# Altium schematic sheet Operational_amplifier.SchDoc: Наименование
size 209 x 297 mm; ApprovedBy: Утвердил; CheckedBy: Проверил; Author: Разработал; CompanyName: Организация; DrawnBy: Н.Контр; Engineer: Т.Контр; SheetNumber: 5; SheetTotal: 6; PageSetup: Record=PageOptions|CenterHorizontal=True|CenterVertical=True|PrintScale=0.94|XCorrection=1.00|YCorrection=1.00|PrintKind=1|BorderSize=5000000|LeftOffset=0|BottomOffset=0|Orientation=1|PaperLength=1000|PaperWidth=1000|Scale=100|PaperSource=7|PrintQuality=-4|MediaType=1|DitherType=10|PaperKind=A4|PrintScaleMode=1; DecimalNumber: Децимальный номер; HeadOfSector: Нач. сектора; MainDevice: Перв.примен.; Name: Наименование; DocumentName: Sheet1.SCHDOC
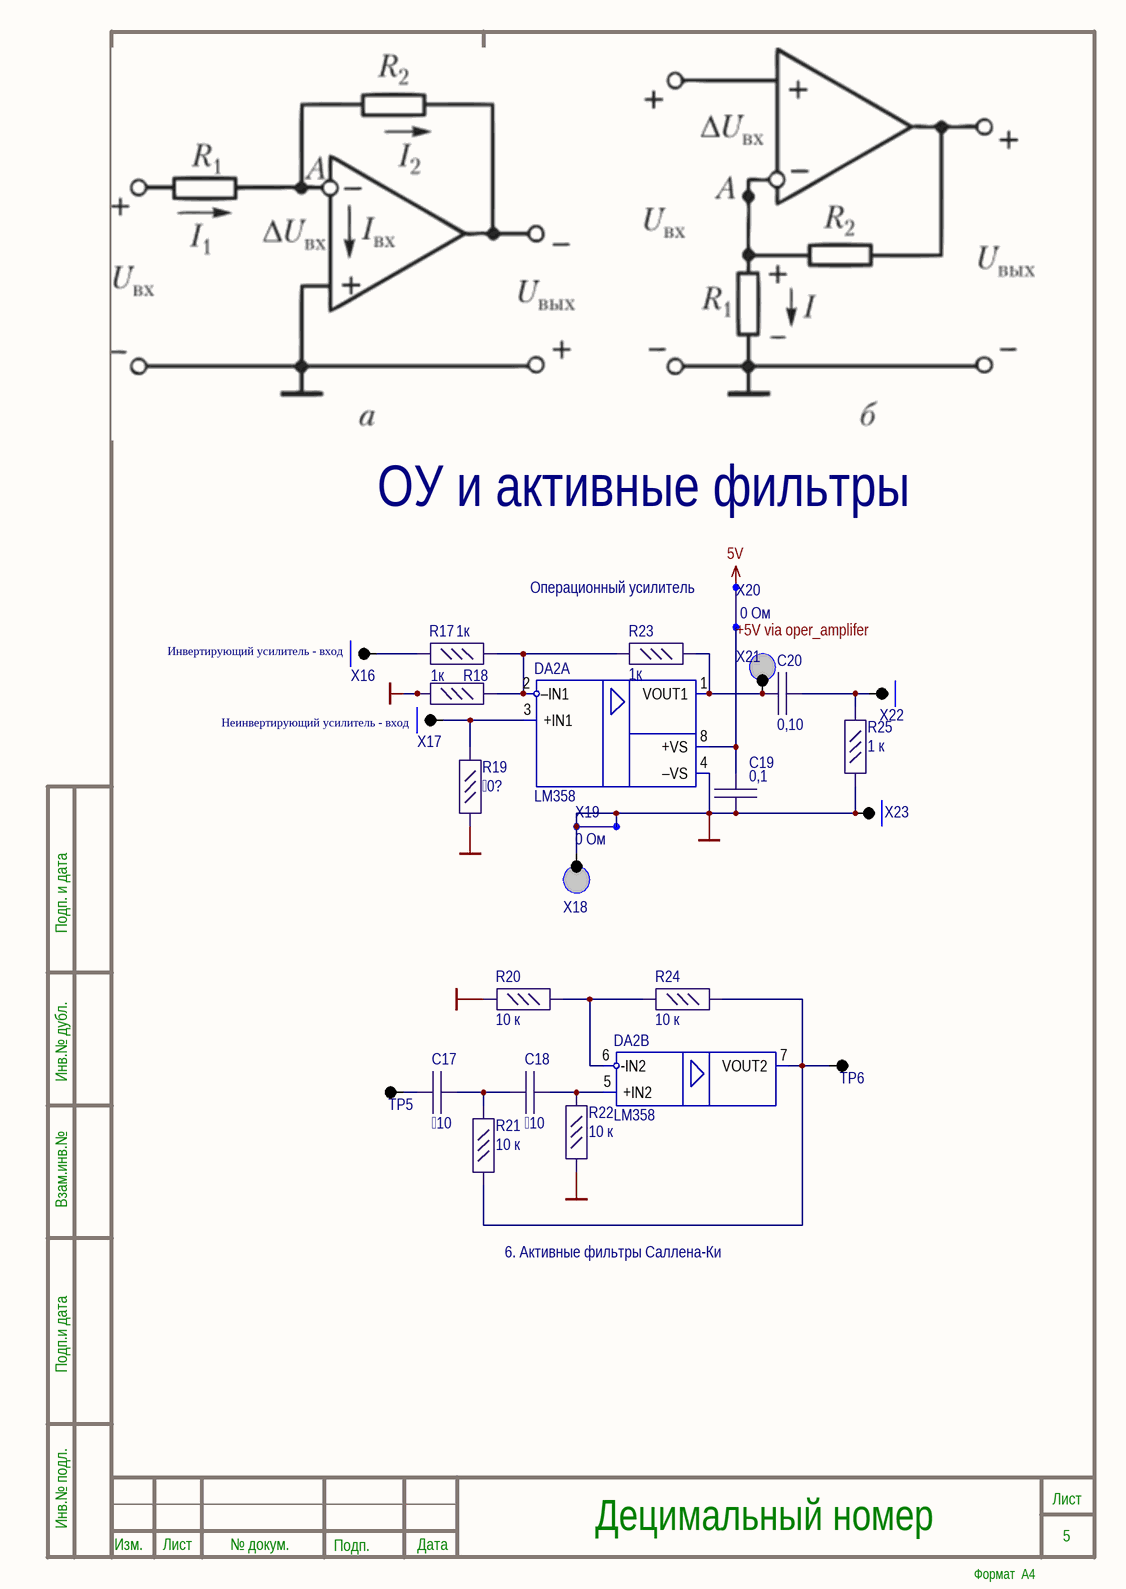
[diagram p0: Operational_amplifier.SchDoc]

## Parts
C17  10  [C_0805]
C18  10  [C_0805]
C19  0,1  [C_0805]
C20  0,10  [C_0805]
DA2  LM358  [SO-8]  (parts A,B of 2)
R17  1к  [R_0805]
R18  1к  [R_0805]
R19  0?  [R_0805]
R20  10 к  [R_0805]
R21  10 к  [R_0805]
R22  10 к  [R_0805]
R23  1к  [R_0805]
R24  10 к  [R_0805]
R25  1 к  [R_0805]
TP5  Test_Point_1  [PLS-1]  (value not drawn)
TP6  Test_Point_1  [PLS-1]  (value not drawn)
X16  КТ  [PLS-1]  (value not drawn)
X17  КТ  [PLS-1]  (value not drawn)
X18  КТ  [PLS-1]  (value not drawn)
X19  0 Ом  [jumper]
X20  0 Ом  [jumper]
X21  КТ  [PLS-1]  (value not drawn)
X22  КТ  [PLS-1]  (value not drawn)
X23  КТ  [PLS-1]  (value not drawn)

## Nets
5V: X20.2
GND: C19.2 DA2.4(–VS) R18.2 R19.2 R20.2 R22.2 R25.2 X18.1 X19.1 X19.2 X23.1
+5V via oper_amplifer: C19.1 DA2.8(+VS) X20.1
NetC17_1: C17.1 TP5.1
NetC17_2: C17.2 C18.1 R21.1
NetC18_2: C18.2 DA2.5(+IN2) R22.1
NetC20_1: C20.1 DA2.1(VOUT1) R23.1 X21.1
NetC20_2: C20.2 R25.1 X22.1
NetDA2_2: DA2.2(–IN1) R17.1 R18.1 R23.2
NetDA2_3: DA2.3(+IN1) R19.1 X17.1
NetDA2_6: DA2.6(-IN2) R20.1 R24.2
NetDA2_7: DA2.7(VOUT2) R21.2 R24.1 TP6.1
NetR17_2: R17.2 X16.1

## Notes on the sheet
- ОУ и активные фильтры
- Операционный усилитель
- (near X16) Инвертирующий усилитель - вход
- (near X17) Неинвертирующий усилитель - вход
- 6. Активные фильтры Саллена-Ки
- Подп. и дата
- Инв.№ дубл.
- Взам.инв.№
- Подп.и дата
- Инв.№ подл.
- Изм.
- Лист
- № докум.
- Подп.
- Дата
- Формат  A4

## Library data of the parts
C17-C20 = GRM188R72A104KA35D: CAP CER 0.1UF 100V X7R 0603; Manufacturer: Murata Electronics; Value: 0.1µF; Part Number: GRM188R72A104KA35D; ComponentLink1URL: https://www.murata.com/~/media/webrenewal/support/library/catalog/products/capacitor/mlcc/c02e.ashx?la=en-us; ComponentLink1Description: Datasheet; Component Type: Capasitor
R17-R19 R23 R25 = CR0603-FX-1002ELF: RES SMD 10K OHM 1% 1/10W 0603; Manufacturer: Bourns Inc.; Value: 10 к; Part Number: CR0603-FX-1002ELF; ComponentLink1URL: https://www.bourns.com/pdfs/chpreztr.pdf; ComponentLink1Description: Datasheet; Component Type: Resistor
R20-R22 R24 = CR0603-FX-1002ELF: RES SMD 10K OHM 1% 1/10W 0603; Manufacturer: Bourns Inc.; Part Number: CR0603-FX-1002ELF; Value: 10 к; ComponentLink1URL: https://www.bourns.com/pdfs/chpreztr.pdf; ComponentLink1Description: Datasheet; Component Type: Resistor
X19 X20 = 0 Ohm (0805)